# EAGLE schematic openvga (EAGLE 4.15)
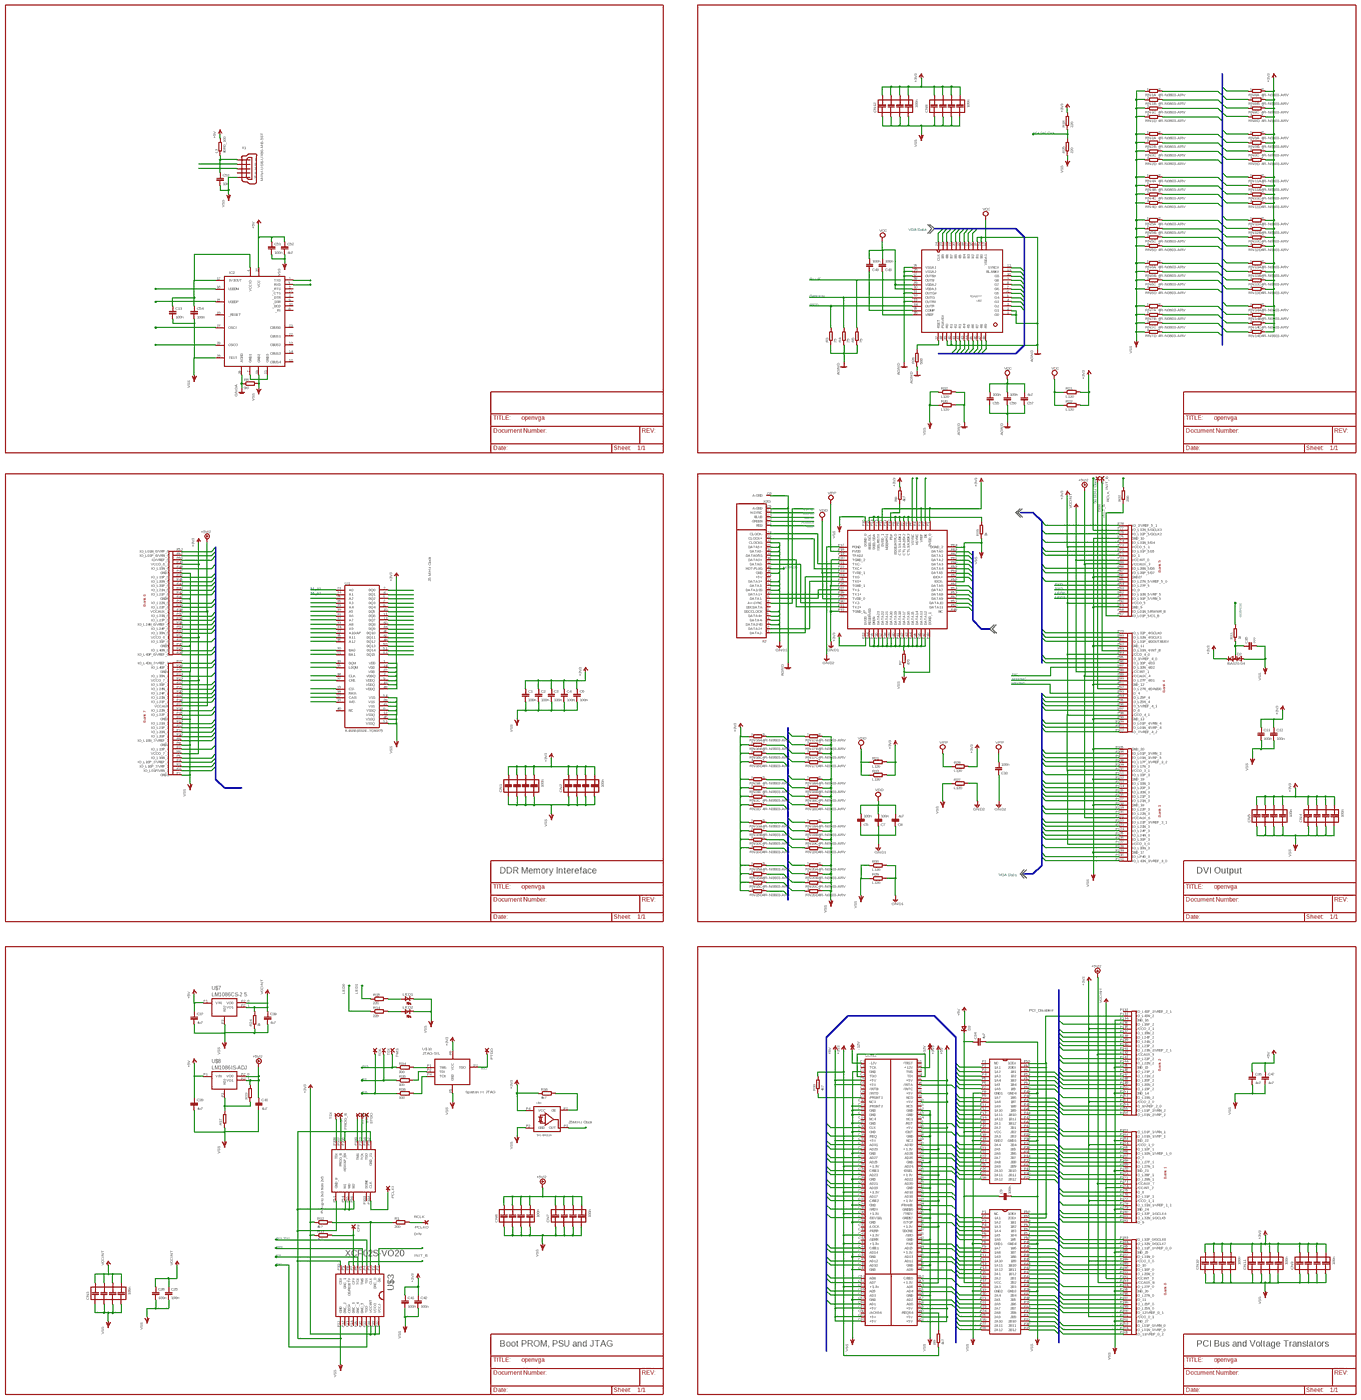
[diagram p0: schematic, sheet 1, overview]
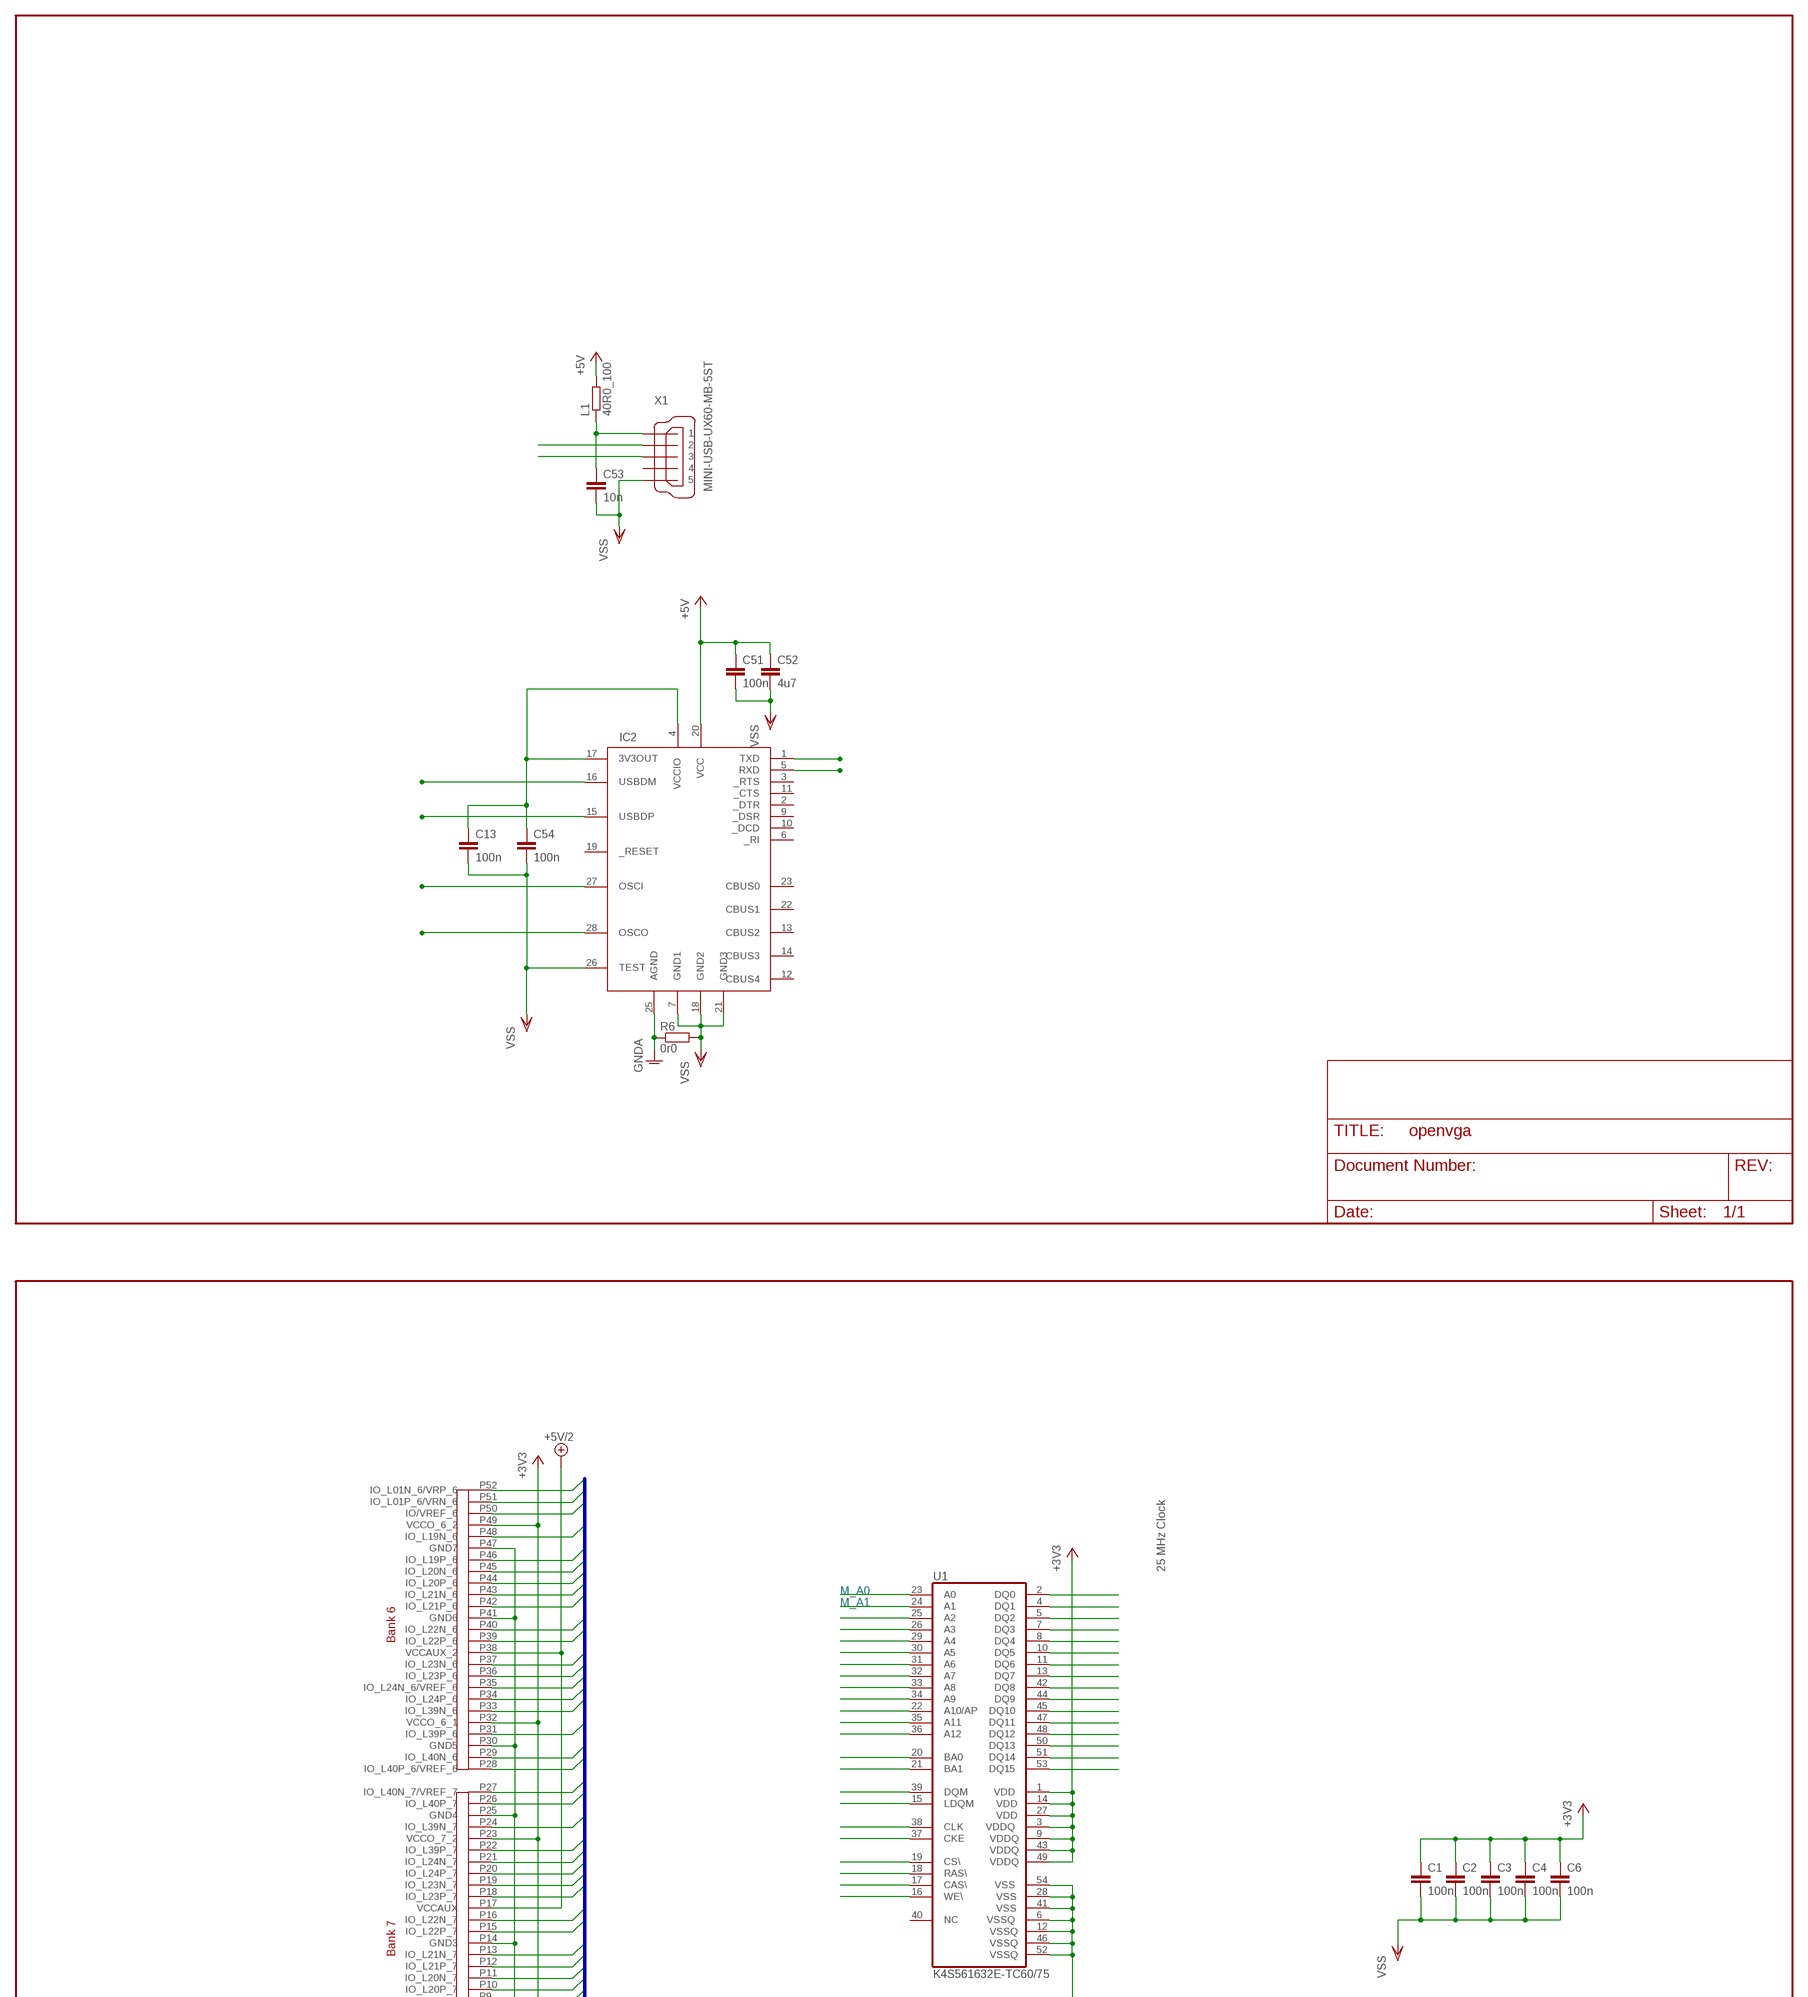
[diagram p1: schematic, sheet 1, part 1 of 4]
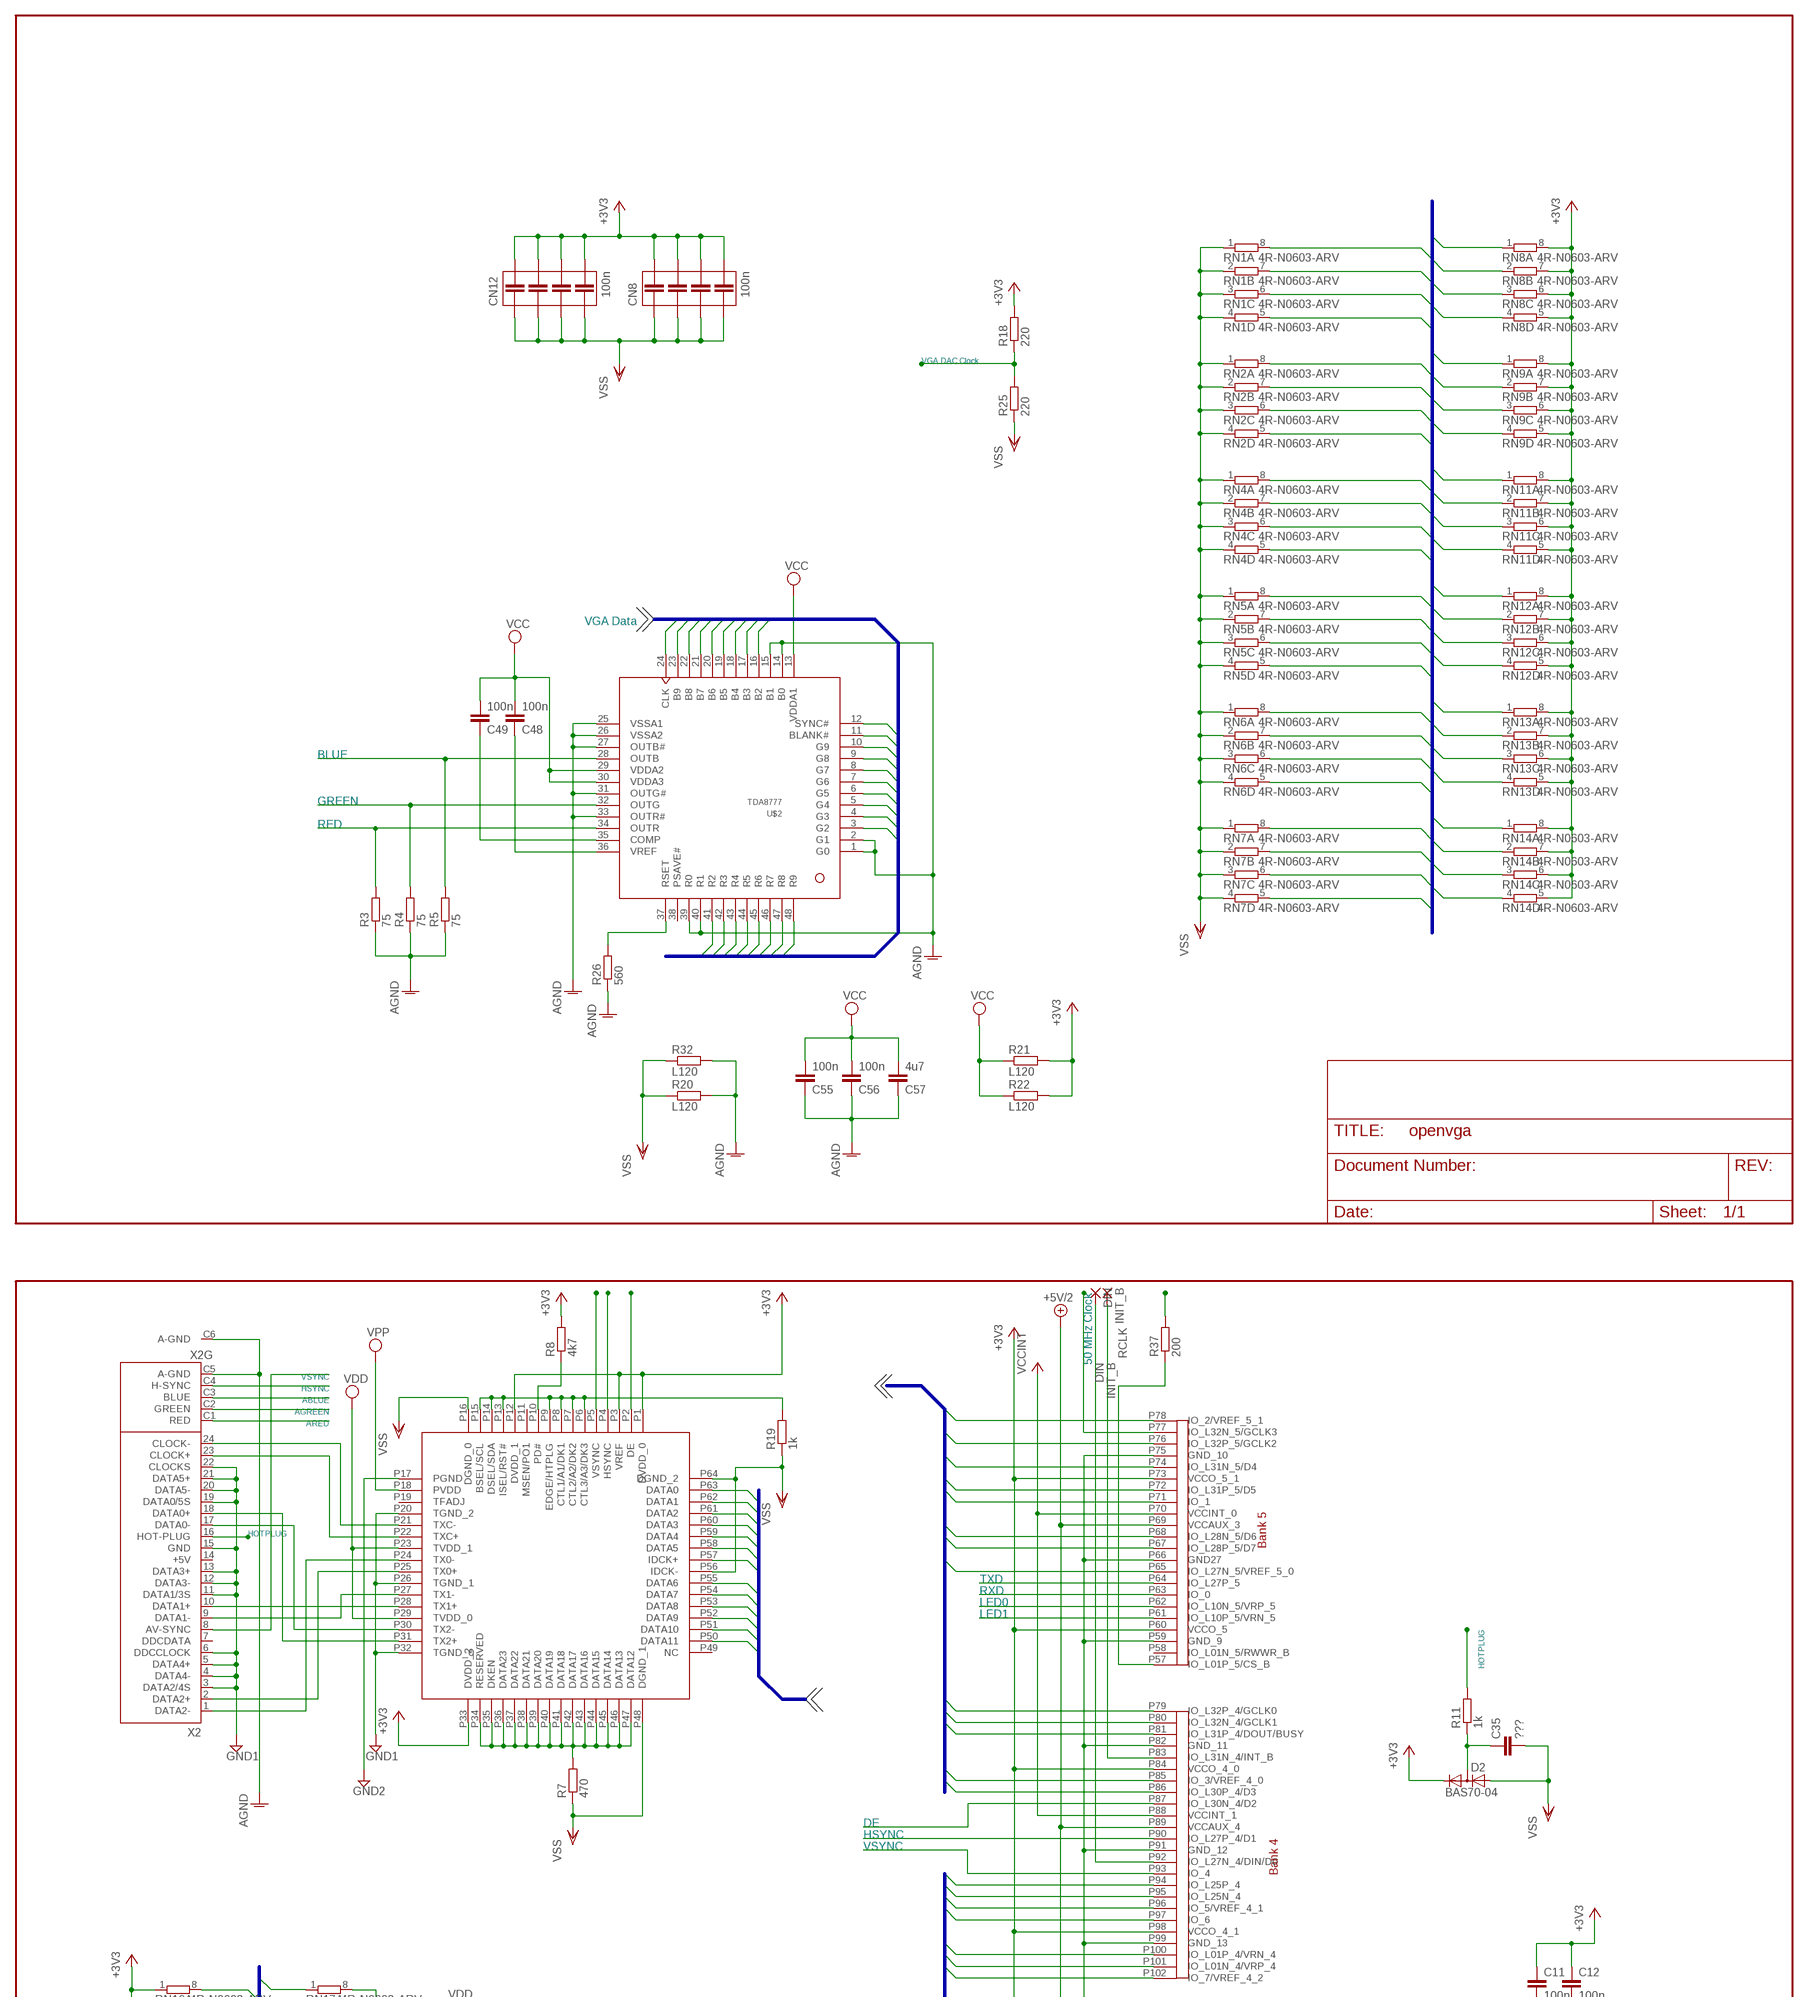
[diagram p2: schematic, sheet 1, part 2 of 4]
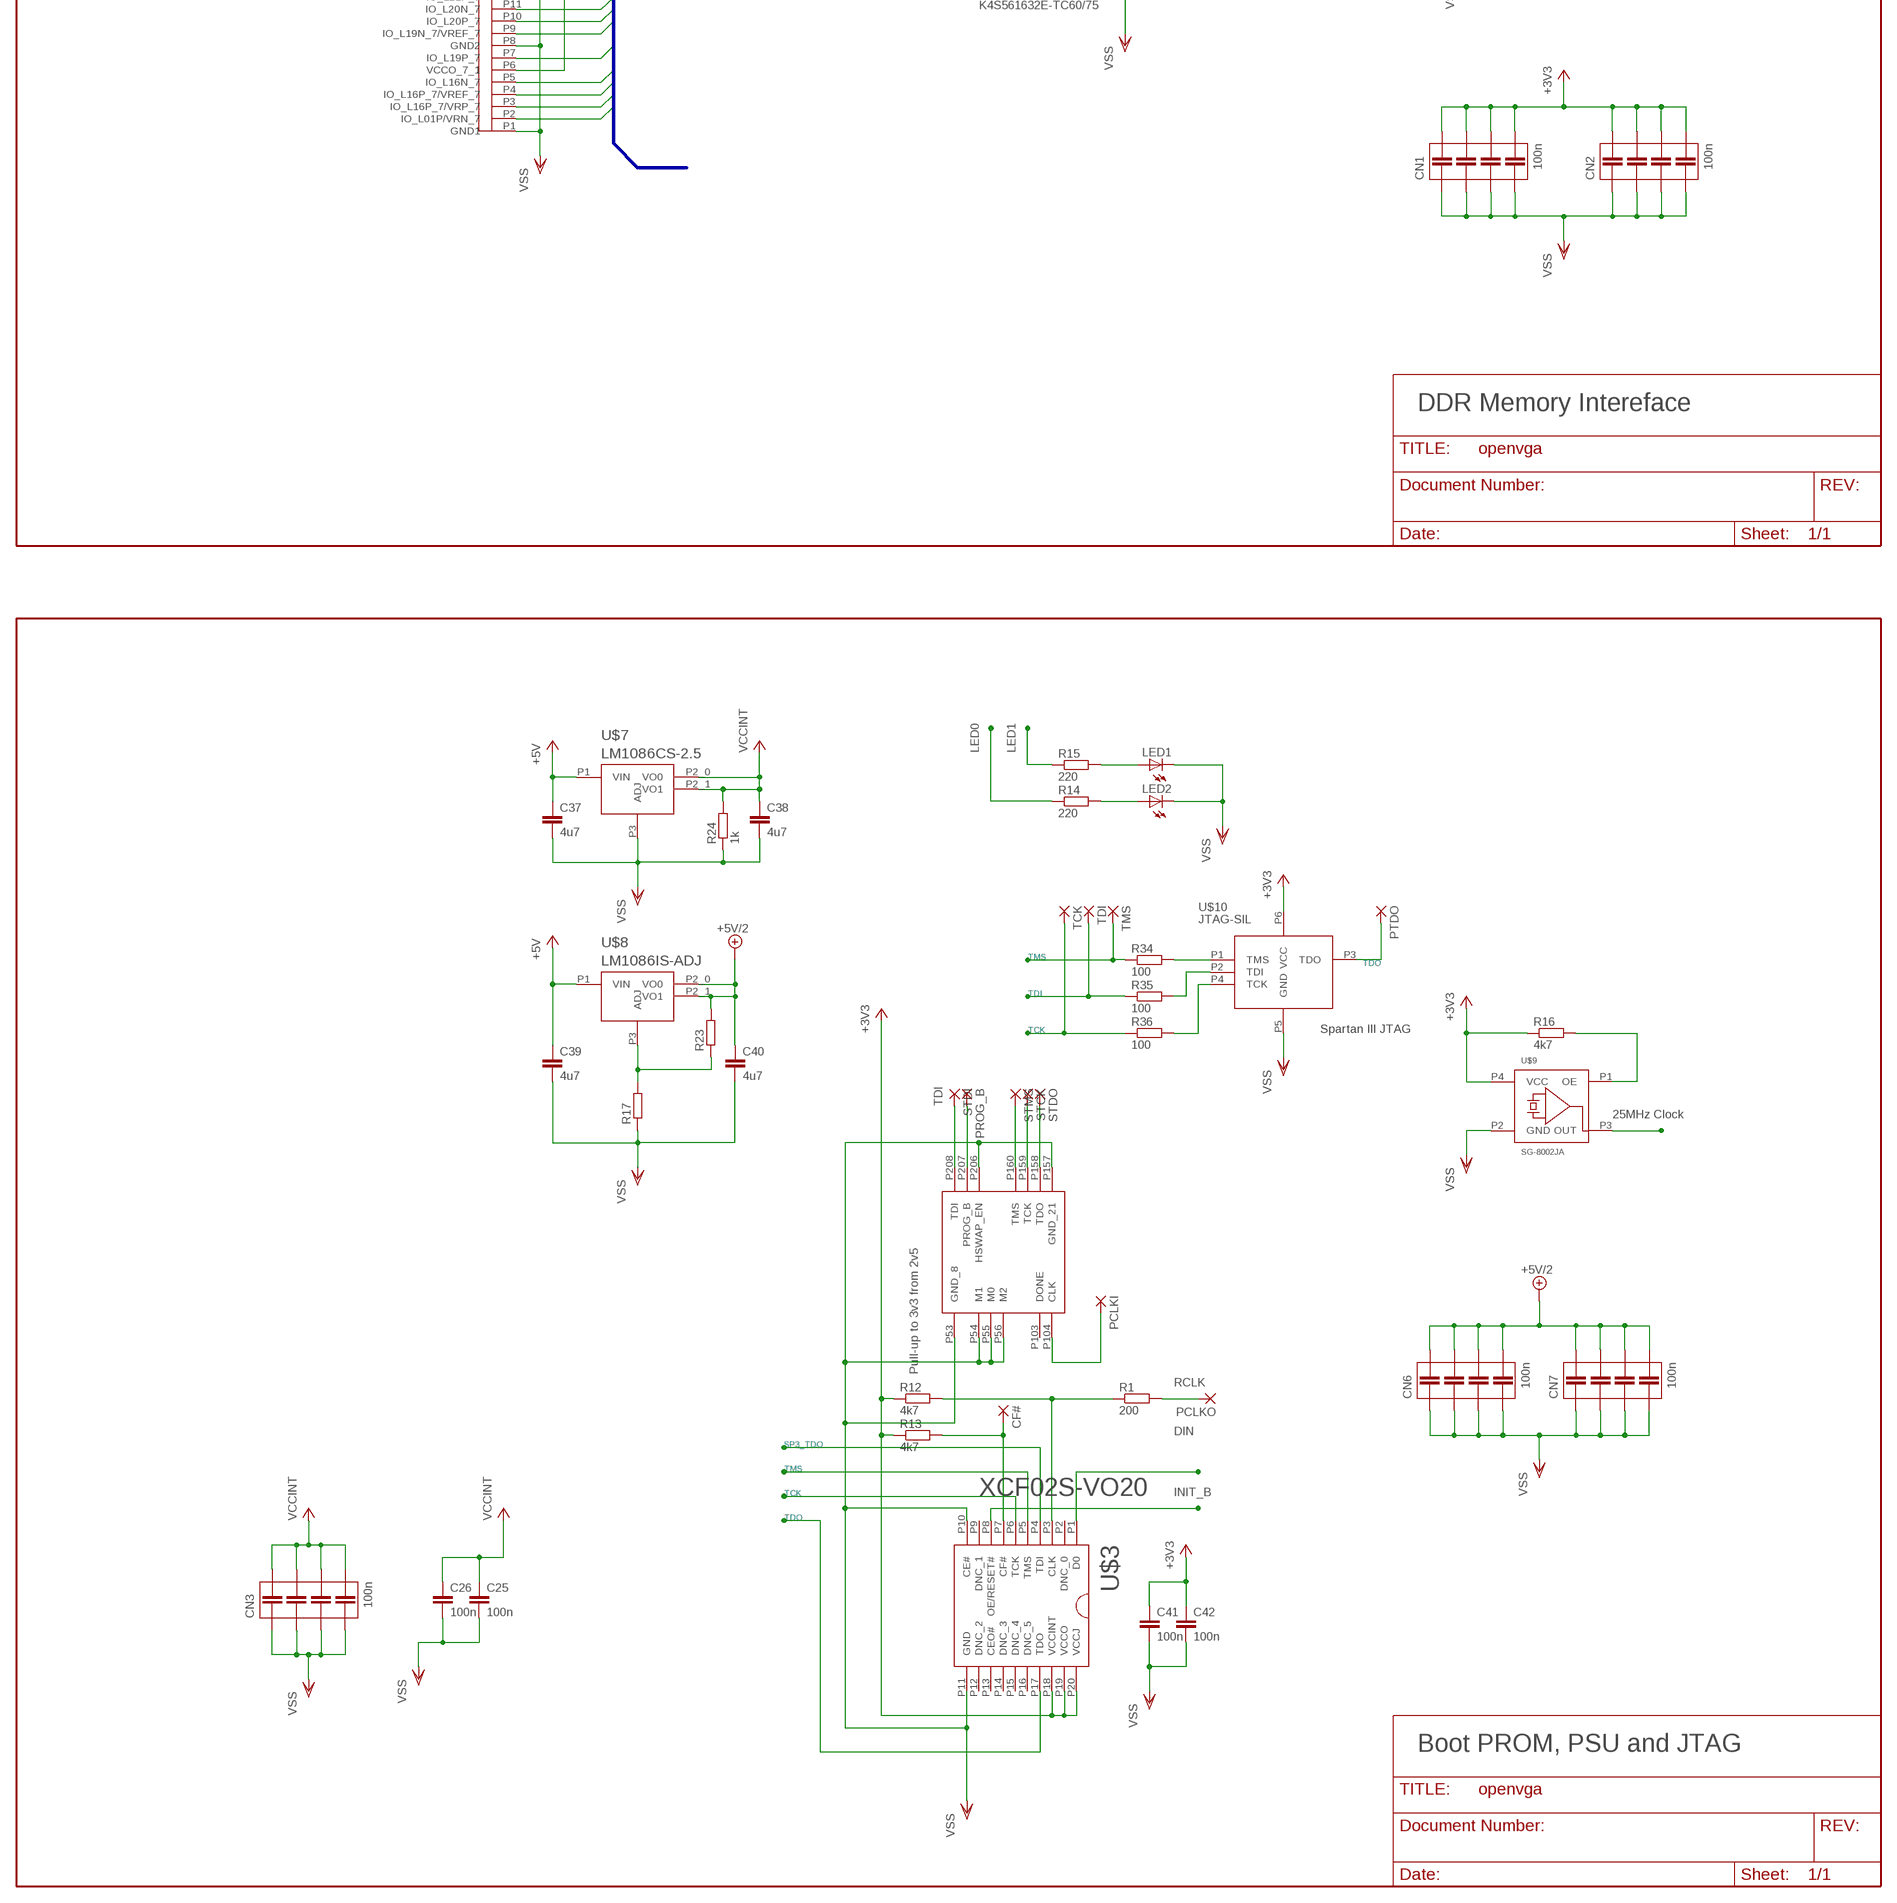
[diagram p3: schematic, sheet 1, part 3 of 4]
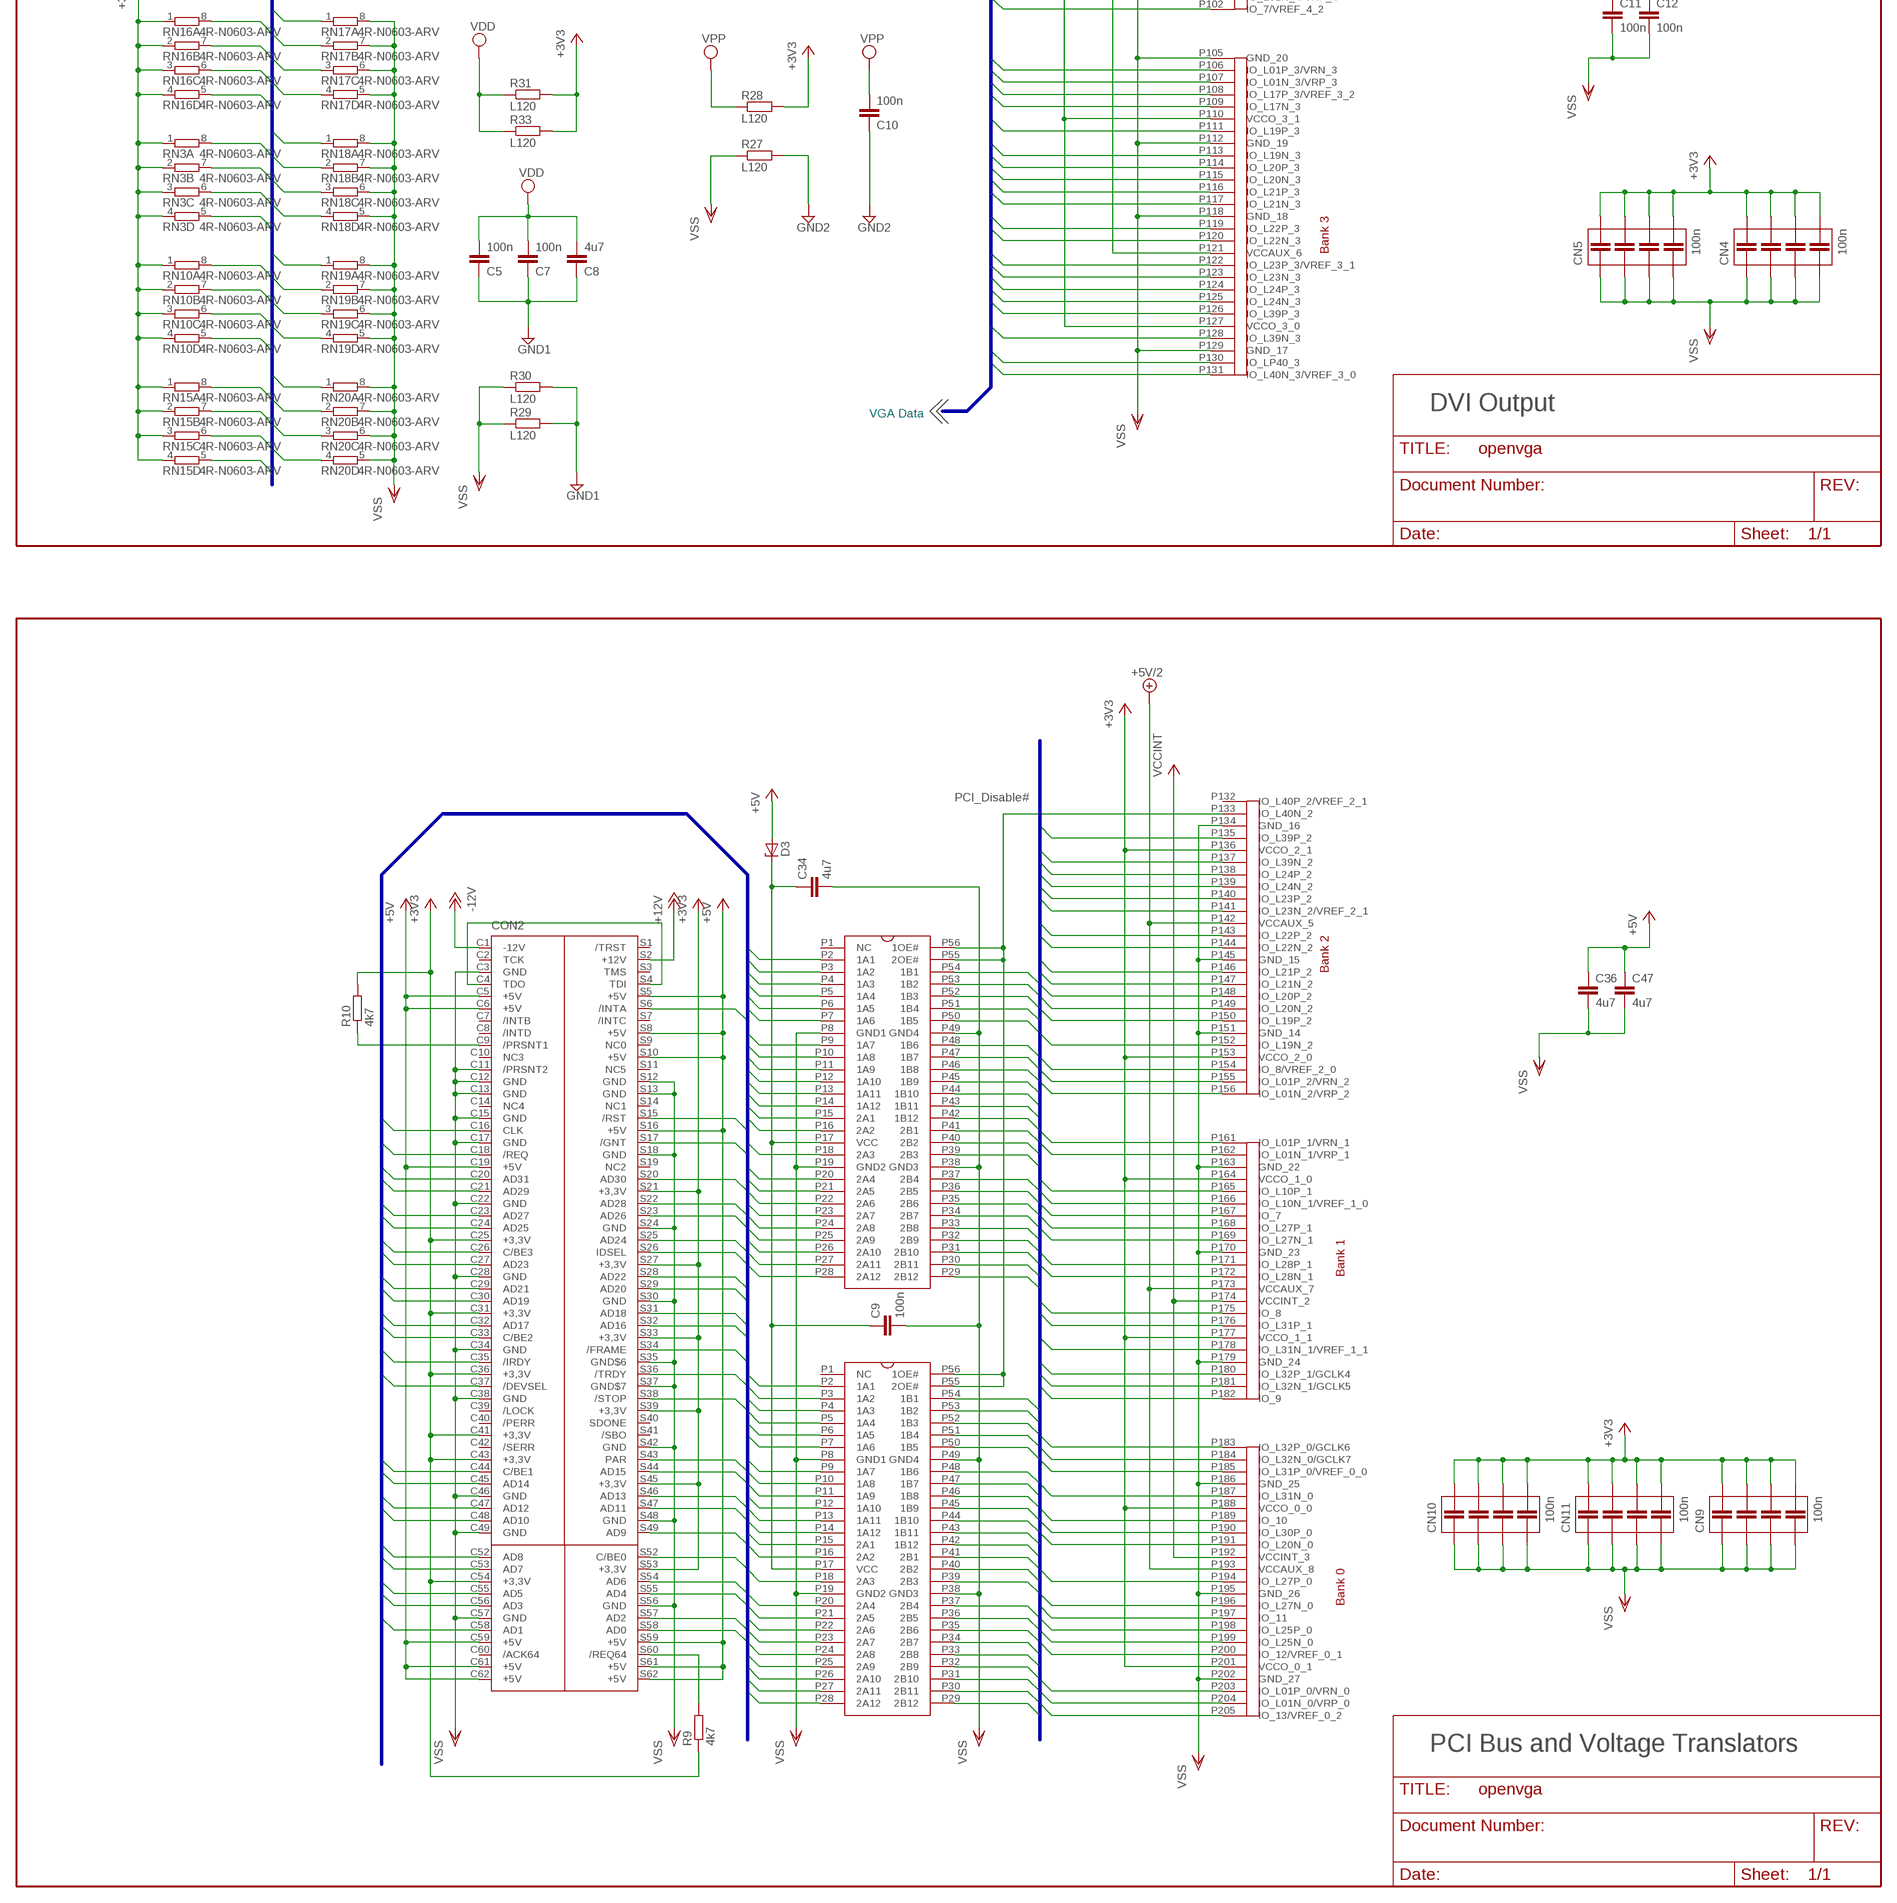
[diagram p4: schematic, sheet 1, part 4 of 4]

## Parts
C1  100n  C-EUC0603K  [C0603K]
C2  100n  C-EUC0603K  [C0603K]
C3  100n  C-EUC0603K  [C0603K]
C4  100n  C-EUC0603K  [C0603K]
C5  100n  C-EUC0603K  [C0603K]
C6  100n  C-EUC0603K  [C0603K]
C7  100n  C-EUC0603K  [C0603K]
C8  4u7  C-EUC0603K  [C0603K]
C9  100n  C-EUC0603K  [C0603K]
C10  100n  C-EUC0603K  [C0603K]
C11  100n  C-EUC0603K  [C0603K]
C12  100n  C-EUC0603K  [C0603K]
C13  100n  C-EUC0603K  [C0603K]
C25  100n  C-EUC0603K  [C0603K]
C26  100n  C-EUC0603K  [C0603K]
C34  4u7  C-EUC0603K  [C0603K]
C35  ???  C-EUC0603K  [C0603K]
C36  4u7  C-EUC0603K  [C0603K]
C37  4u7  C-EUC0603K  [C0603K]
C38  4u7  C-EUC0603K  [C0603K]
C39  4u7  C-EUC0603K  [C0603K]
C40  4u7  C-EUC0603K  [C0603K]
C41  100n  C-EUC0603K  [C0603K]
C42  100n  C-EUC0603K  [C0603K]
C47  4u7  C-EUC0603K  [C0603K]
C48  100n  C-EUC0603K  [C0603K]
C49  100n  C-EUC0603K  [C0603K]
C51  100n  C-EUC0603K  [C0603K]
C52  4u7  C-EUC0603K  [C0603K]
C53  10n  C-EUC0603K  [C0603K]
C54  100n  C-EUC0603K  [C0603K]
C55  100n  C-EUC0603K  [C0603K]
C56  100n  C-EUC0603K  [C0603K]
C57  4u7  C-EUC0603K  [C0603K]
CF#  1,6/0,8  [1,6/0,8]
CN1  100n  GNM214B11C104MA01D  [CA4_0805]
CN2  100n  GNM214B11C104MA01D  [CA4_0805]
CN3  100n  GNM214B11C104MA01D  [CA4_0805]
CN4  100n  GNM214B11C104MA01D  [CA4_0805]
CN5  100n  GNM214B11C104MA01D  [CA4_0805]
CN6  100n  GNM214B11C104MA01D  [CA4_0805]
CN7  100n  GNM214B11C104MA01D  [CA4_0805]
CN8  100n  GNM214B11C104MA01D  [CA4_0805]
CN9  100n  GNM214B11C104MA01D  [CA4_0805]
CN10  100n  GNM214B11C104MA01D  [CA4_0805]
CN11  100n  GNM214B11C104MA01D  [CA4_0805]
CN12  100n  GNM214B11C104MA01D  [CA4_0805]
CON2  PCI_CON  [PCI_BRDL]
D2  BAS70-04  [SOT23]
D3  ZENER-DIODESOD80C  [SOD80C]
DIN  1,6/0,8  [1,6/0,8]
IC2  FT232RL  [SSOP28DB]
INIT_B  1,6/0,8  [1,6/0,8]
L1  40R0_100  R-EU_R0805  [R0805]
LED1  LEDSMT1206  [1206]
LED2  LEDSMT1206  [1206]
PCLKI  1,6/0,8  [1,6/0,8]
PCLKO  1,6/0,8  [1,6/0,8]
PROG_B  1,6/0,8  [1,6/0,8]
PTDO  1,6/0,8  [1,6/0,8]
R1  200  R-EU_R0603  [R0603]
R3  75  R-EU_R0603  [R0603]
R4  75  R-EU_R0603  [R0603]
R5  75  R-EU_R0603  [R0603]
R6  0r0  R-EU_R0603  [R0603]
R7  470  R-EU_R0603  [R0603]
R8  4k7  R-EU_R0603  [R0603]
R9  4k7  R-EU_R0603  [R0603]
R10  4k7  R-EU_R0603  [R0603]
R11  1k  R-EU_R0603  [R0603]
R12  4k7  R-EU_R0603  [R0603]
R13  4k7  R-EU_R0603  [R0603]
R14  220  R-EU_R0603  [R0603]
R15  220  R-EU_R0603  [R0603]
R16  4k7  R-EU_R0603  [R0603]
R17  R-EU_R0603  [R0603]
R18  220  R-EU_R0603  [R0603]
R19  1k  R-EU_R0603  [R0603]
R20  L120  R-EU_R0805  [R0805]
R21  L120  R-EU_R0805  [R0805]
R22  L120  R-EU_R0805  [R0805]
R23  R-EU_R0603  [R0603]
R24  1k  R-EU_R0603  [R0603]
R25  220  R-EU_R0603  [R0603]
R26  560  R-EU_R0603  [R0603]
R27  L120  R-EU_R0805  [R0805]
R28  L120  R-EU_R0805  [R0805]
R29  L120  R-EU_R0805  [R0805]
R30  L120  R-EU_R0805  [R0805]
R31  L120  R-EU_R0805  [R0805]
R32  L120  R-EU_R0805  [R0805]
R33  L120  R-EU_R0805  [R0805]
R34  100  R-EU_R0603  [R0603]
R35  100  R-EU_R0603  [R0603]
R36  100  R-EU_R0603  [R0603]
R37  200  R-EU_R0603  [R0603]
RN1  4R-N0603-ARV  [0603-ARV]
RN2  4R-N0603-ARV  [0603-ARV]
RN3  4R-N0603-ARV  [0603-ARV]
RN4  4R-N0603-ARV  [0603-ARV]
RN5  4R-N0603-ARV  [0603-ARV]
RN6  4R-N0603-ARV  [0603-ARV]
RN7  4R-N0603-ARV  [0603-ARV]
RN8  4R-N0603-ARV  [0603-ARV]
RN9  4R-N0603-ARV  [0603-ARV]
RN10  4R-N0603-ARV  [0603-ARV]
RN11  4R-N0603-ARV  [0603-ARV]
RN12  4R-N0603-ARV  [0603-ARV]
RN13  4R-N0603-ARV  [0603-ARV]
RN14  4R-N0603-ARV  [0603-ARV]
RN15  4R-N0603-ARV  [0603-ARV]
RN16  4R-N0603-ARV  [0603-ARV]
RN17  4R-N0603-ARV  [0603-ARV]
RN18  4R-N0603-ARV  [0603-ARV]
RN19  4R-N0603-ARV  [0603-ARV]
RN20  4R-N0603-ARV  [0603-ARV]
STCK  1,6/0,8  [1,6/0,8]
STDI  1,6/0,8  [1,6/0,8]
STDO  1,6/0,8  [1,6/0,8]
STMS  1,6/0,8  [1,6/0,8]
TCK  1,6/0,8  [1,6/0,8]
TDI  1,6/0,8  [1,6/0,8]
TMS  1,6/0,8  [1,6/0,8]
U1  K4S561632E-TC60/75  [TSOP54]
U$1  XC3S200-PQ208-2'TQFP'  [PQ208]
U$2  TDA8777  [LQFP-48]
U$3  XCF02S-VO20  [VO20]
U$4  SIL164  [TQFP64]
U$5  CBT16211DDG  [TSSOP56]
U$6  CBT16211DDG  [TSSOP56]
U$7  LM1086CS-2.5  LM1086IS-ADJ  [TO-263]
U$8  LM1086IS-ADJ  [TO-263]
U$9  SG-8002JA  [SG-8002JC]
U$10  JTAG-SIL  [JTAG-SIL]
X1  MINI-USB-UX60-MB-5ST  [UX60-MB-5ST]
X2  DVI-I-R  [DVI-I-R]

## Nets
3V_AD0: U$1.P205(IO_13/VREF_0_2) U$6.P29(2B12)
3V_AD1: U$1.P204(IO_L01N_0/VRP_0) U$6.P30(2B11)
3V_AD2: U$1.P203(IO_L01P_0/VRN_0) U$6.P31(2B10)
3V_AD3: U$1.P200(IO_12/VREF_0_1) U$6.P32(2B9)
3V_AD4: U$1.P199(IO_L25N_0) U$6.P33(2B8)
3V_AD5: U$1.P198(IO_L25P_0) U$6.P34(2B7)
3V_AD6: U$1.P197(IO_11) U$6.P35(2B6)
3V_AD7: U$1.P196(IO_L27N_0) U$6.P36(2B5)
3V_AD8: U$1.P191(IO_L20N_0) U$6.P39(2B3)
3V_AD9: U$1.P190(IO_L30P_0) U$6.P40(2B2)
3V_AD10: U$1.P189(IO_10) U$6.P41(2B1)
3V_AD11: U$1.P187(IO_L31N_0) U$6.P42(1B12)
3V_AD12: U$1.P185(IO_L31P_0/VREF_0_0) U$6.P43(1B11)
3V_AD13: U$1.P184(IO_L32N_0/GCLK7) U$6.P44(1B10)
3V_AD14: U$1.P183(IO_L32P_0/GCLK6) U$6.P45(1B9)
3V_AD15: U$1.P182(IO_9) U$6.P46(1B8)
3V_AD16: U$1.P167(IO_7) U$5.P30(2B11)
3V_AD17: U$1.P166(IO_L10N_1/VREF_1_0) U$5.P31(2B10)
3V_AD18: U$1.P165(IO_L10P_1) U$5.P32(2B9)
3V_AD19: U$1.P162(IO_L01N_1/VRP_1) U$5.P33(2B8)
3V_AD20: U$1.P161(IO_L01P_1/VRN_1) U$5.P34(2B7)
3V_AD21: U$1.P156(IO_L01N_2/VRP_2) U$5.P35(2B6)
3V_AD22: U$1.P155(IO_L01P_2/VRN_2) U$5.P36(2B5)
3V_AD23: U$1.P154(IO_8/VREF_2_0) U$5.P37(2B4)
3V_AD24: U$1.P149(IO_L20N_2) U$5.P41(2B1)
3V_AD25: U$1.P148(IO_L20P_2) U$5.P42(1B12)
3V_AD26: U$1.P147(IO_L21N_2) U$5.P43(1B11)
3V_AD27: U$1.P146(IO_L21P_2) U$5.P44(1B10)
3V_AD28: U$1.P144(IO_L22N_2) U$5.P45(1B9)
3V_AD29: U$1.P143(IO_L22P_2) U$5.P46(1B8)
3V_AD30: U$1.P141(IO_L23N_2/VREF_2_1) U$5.P47(1B7)
3V_AD31: U$1.P140(IO_L23P_2) U$5.P48(1B6)
3V_CBE#0: U$1.P194(IO_L27P_0) U$6.P37(2B4)
3V_CBE#1: U$1.P181(IO_L32N_1/GCLK5) U$6.P47(1B7)
3V_CBE#2: U$1.P168(IO_L27P_1) U$5.P29(2B12)
3V_CBE#3: U$1.P150(IO_L19P_2) U$5.P40(2B2)
3V_CLK: U$1.P180(IO_L32P_1/GCLK4) U$5.P52(1B3)
3V_DEVSEL#: U$1.P175(IO_8) U$6.P51(1B4)
3V_FRAME#: U$1.P169(IO_L27N_1) U$6.P54(1B1)
3V_GNT#: U$1.P138(IO_L24P_2) U$5.P51(1B4)
3V_IDSEL: U$1.P152(IO_L19N_2) U$5.P39(2B3)
3V_INTA#: U$1.P135(IO_L39P_2) U$5.P54(1B1)
3V_IRDY#: U$1.P171(IO_L28P_1) U$6.P53(1B2)
3V_PAR: U$1.P178(IO_L31N_1/VREF_1_1) U$6.P48(1B6)
3V_REQ#: U$1.P139(IO_L24N_2) U$5.P50(1B5)
3V_RST#: U$1.P137(IO_L39N_2) U$5.P53(1B2)
3V_STOP#: U$1.P176(IO_L31P_1) U$6.P50(1B5)
3V_TRDY#: U$1.P172(IO_L28N_1) U$6.P52(1B3)
5V_AD0: CON2.S58(AD0) U$6.P28(2A12)
5V_AD1: CON2.C58(AD1) U$6.P27(2A11)
5V_AD2: CON2.S57(AD2) U$6.P26(2A10)
5V_AD3: CON2.C56(AD3) U$6.P25(2A9)
5V_AD4: CON2.S55(AD4) U$6.P24(2A8)
5V_AD5: CON2.C55(AD5) U$6.P23(2A7)
5V_AD6: CON2.S54(AD6) U$6.P22(2A6)
5V_AD7: CON2.C53(AD7) U$6.P21(2A5)
5V_AD8: CON2.C52(AD8) U$6.P18(2A3)
5V_AD9: CON2.S49(AD9) U$6.P16(2A2)
5V_AD10: CON2.C48(AD10) U$6.P15(2A1)
5V_AD11: CON2.S47(AD11) U$6.P14(1A12)
5V_AD12: CON2.C47(AD12) U$6.P13(1A11)
5V_AD13: CON2.S46(AD13) U$6.P12(1A10)
5V_AD14: CON2.C45(AD14) U$6.P11(1A9)
5V_AD15: CON2.S44(AD15) U$6.P10(1A8)
5V_AD16: CON2.S32(AD16) U$5.P27(2A11)
5V_AD17: CON2.C32(AD17) U$5.P26(2A10)
5V_AD18: CON2.S31(AD18) U$5.P25(2A9)
5V_AD19: CON2.C30(AD19) U$5.P24(2A8)
5V_AD20: CON2.S29(AD20) U$5.P23(2A7)
5V_AD21: CON2.C29(AD21) U$5.P22(2A6)
5V_AD22: CON2.S28(AD22) U$5.P21(2A5)
5V_AD23: CON2.C27(AD23) U$5.P20(2A4)
5V_AD24: CON2.S25(AD24) U$5.P15(2A1)
5V_AD25: CON2.C24(AD25) U$5.P14(1A12)
5V_AD26: CON2.S23(AD26) U$5.P13(1A11)
5V_AD27: CON2.C23(AD27) U$5.P12(1A10)
5V_AD28: CON2.S22(AD28) U$5.P11(1A9)
5V_AD29: CON2.C21(AD29) U$5.P10(1A8)
5V_AD30: CON2.S20(AD30) U$5.P9(1A7)
5V_AD31: CON2.C20(AD31) U$5.P7(1A6)
5V_CBE#0: CON2.S52(C/BE0) U$6.P20(2A4)
5V_CBE#1: CON2.C44(C/BE1) U$6.P9(1A7)
5V_CBE#2: CON2.C33(C/BE2) U$5.P28(2A12)
5V_CBE#3: CON2.C26(C/BE3) U$5.P16(2A2)
5V_CLK: CON2.C16(CLK) U$5.P4(1A3)
5V_DEVSEL#: CON2.C37(/DEVSEL) U$6.P5(1A4)
5V_FRAME#: CON2.S34(/FRAME) U$6.P2(1A1)
5V_GNT#: CON2.S17(/GNT) U$5.P5(1A4)
5V_IDSEL: CON2.S26(IDSEL) U$5.P18(2A3)
5V_INTA#: CON2.S6(/INTA) U$5.P2(1A1)
5V_IRDY#: CON2.C35(/IRDY) U$6.P3(1A2)
5V_PAR: CON2.S43(PAR) U$6.P7(1A6)
5V_REQ#: CON2.C18(/REQ) U$5.P6(1A5)
5V_RST#: CON2.S15(/RST) U$5.P3(1A2)
5V_STOP#: CON2.S38(/STOP) U$6.P6(1A5)
5V_TRDY#: CON2.S36(/TRDY) U$6.P4(1A3)
+3V3: C1.1 C2.1 C3.1 C4.1 C6.1 C11.1 C12.1 C41.1 C42.1 CN1.1 CN1.2 CN1.3 CN1.4 CN2.1 CN2.2 CN2.3 CN2.4 CN4.1 CN4.2 CN4.3 CN4.4 CN5.1 CN5.2 CN5.3 CN5.4 CN8.1 CN8.2 CN8.3 CN8.4 CN9.1 CN9.2 CN9.3 CN9.4 CN10.1 CN10.2 CN10.3 CN10.4 CN11.1 CN11.2 CN11.3 CN11.4 CN12.1 CN12.2 CN12.3 CN12.4 CON2.C25(+3,3V) CON2.C31(+3,3V) CON2.C36(+3,3V) CON2.C41(+3,3V) CON2.C43(+3,3V) CON2.C54(+3,3V) CON2.S21(+3,3V) CON2.S27(+3,3V) CON2.S33(+3,3V) CON2.S39(+3,3V) CON2.S45(+3,3V) CON2.S53(+3,3V) D2.2(C) R8.2 R9.1 R10.2 R12.1 R13.1 R16.1 R18.2 R21.2 R22.2 R28.2 R31.2 R33.2 RN3.1 RN3.2 RN3.3 RN3.4 RN8.5 RN8.6 RN8.7 RN8.8 RN9.5 RN9.6 RN9.7 RN9.8 RN10.1 RN10.2 RN10.3 RN10.4 RN11.5 RN11.6 RN11.7 RN11.8 RN12.5 RN12.6 RN12.7 RN12.8 RN13.5 RN13.6 RN13.7 RN13.8 RN14.5 RN14.6 RN14.7 RN14.8 RN15.1 RN15.2 RN15.3 RN15.4 RN16.1 RN16.2 RN16.3 RN16.4 U1.1(VDD) U1.3(VDDQ) U1.9(VDDQ) U1.14(VDD) U1.27(VDD) U1.43(VDDQ) U1.49(VDDQ) U$1.P6(VCCO_7_1) U$1.P23(VCCO_7_2) U$1.P32(VCCO_6_1) U$1.P49(VCCO_6_2) U$1.P60(VCCO_5) U$1.P73(VCCO_5_1) U$1.P84(VCCO_4_0) U$1.P98(VCCO_4_1) U$1.P110(VCCO_3_1) U$1.P127(VCCO_3_0) U$1.P136(VCCO_2_1) U$1.P153(VCCO_2_0) U$1.P164(VCCO_1_0) U$1.P177(VCCO_1_1) U$1.P188(VCCO_0_0) U$1.P201(VCCO_0_1) U$3.P18(VCCINT) U$3.P19(VCCO) U$3.P20(VCCJ) U$4.P1(DVDD_0) U$4.P3(VREF) U$4.P12(DVDD_1) U$4.P33(DVDD_2) U$9.P4(VCC) U$10.P6(VCC)
+4V2: C9.1 C34.1 D3.C U$5.P17(VCC) U$6.P17(VCC)
+5V: C36.1 C37.1 C39.1 C47.1 C51.1 C52.1 CON2.C5(+5V) CON2.C6(+5V) CON2.C19(+5V) CON2.C59(+5V) CON2.C61(+5V) CON2.C62(+5V) CON2.S5(+5V) CON2.S8(+5V) CON2.S10(+5V) CON2.S16(+5V) CON2.S59(+5V) CON2.S61(+5V) CON2.S62(+5V) D3.A IC2.20(VCC) L1.2 U$7.P1(VIN) U$8.P1(VIN)
+5V/2: C40.1 CN6.1 CN6.2 CN6.3 CN6.4 CN7.1 CN7.2 CN7.3 CN7.4 R23.2 U$1.P17(VCCAUX) U$1.P38(VCCAUX_2) U$1.P69(VCCAUX_3) U$1.P89(VCCAUX_4) U$1.P121(VCCAUX_6) U$1.P142(VCCAUX_5) U$1.P173(VCCAUX_7) U$1.P193(VCCAUX_8) U$8.P2_0(VO0) U$8.P2_1(VO1)
+12V: CON2.S2(+12V)
-12V: CON2.C1(-12V)
ABLUE: R5.2 U$2.28(OUTB) X2.C3(BLUE)
AGND: C55.1 C56.1 C57.1 R3.1 R4.1 R5.1 R20.2 R26.1 R32.2 U$2.1(G0) U$2.2(G1) U$2.14(B0) U$2.15(B1) U$2.25(VSSA1) U$2.26(VSSA2) U$2.27(OUTB#) U$2.31(OUTG#) U$2.33(OUTR#) U$2.39(R0) U$2.40(R1) X2.C5(A-GND) X2.C6(A-GND)
AGREEN: R4.2 U$2.32(OUTG) X2.C2(GREEN)
ARED: R3.2 U$2.34(OUTR) X2.C1(RED)
B2: RN6.8 RN13.4 U$1.P120(IO_L22N_3) U$2.16(B2)
B3: RN6.7 RN13.3 U$1.P122(IO_L23P_3/VREF_3_1) U$2.17(B3)
B4: RN6.6 RN13.2 U$1.P123(IO_L23N_3) U$2.18(B4)
B5: RN6.5 RN13.1 U$1.P124(IO_L24P_3) U$2.19(B5)
B6: RN7.8 RN14.4 U$1.P125(IO_L24N_3) U$2.20(B6)
B7: RN7.7 RN14.3 U$1.P126(IO_L39P_3) U$2.21(B7)
B8: RN7.6 RN14.2 U$1.P128(IO_L39N_3) U$2.22(B8)
B9: RN7.5 RN14.1 U$1.P130(IO_LP40_3) U$2.23(B9)
BLANK#: U$1.P117(IO_L21N_3) U$2.11(BLANK#)
CCLK: R1.1 R12.2 U$3.P3(CLK)
CLK25: U$1.P77(IO_L32N_5/GCLK3) U$9.P3(OUT)
DE: RN16.7 RN17.3 U$1.P87(IO_L30N_4/D2) U$4.P2(DE)
DIN: U$3.P1(D0)
DVICLK: RN10.6 RN19.2 U$1.P76(IO_L32P_5/GCLK2) U$4.P57(IDCK+)
DVID0: RN16.8 RN17.4 U$1.P86(IO_L30P_4/D3) U$4.P63(DATA0)
DVID1: RN3.5 RN18.1 U$1.P85(IO_3/VREF_4_0) U$4.P62(DATA1)
DVID2: RN3.6 RN18.2 U$1.P81(IO_L31P_4/DOUT/BUSY) U$4.P61(DATA2)
DVID3: RN3.7 RN18.3 U$1.P80(IO_L32N_4/GCLK1) U$4.P60(DATA3)
DVID4: RN3.8 RN18.4 U$1.P79(IO_L32P_4/GCLK0) U$4.P59(DATA4)
DVID5: RN10.5 RN19.1 U$1.P78(IO_2/VREF_5_1) U$4.P58(DATA5)
DVID6: RN10.7 RN19.3 U$1.P74(IO_L31N_5/D4) U$4.P55(DATA6)
DVID7: RN10.8 RN19.4 U$1.P72(IO_L31P_5/D5) U$4.P54(DATA7)
DVID8: RN15.5 RN20.1 U$1.P71(IO_1) U$4.P53(DATA8)
DVID9: RN15.6 RN20.2 U$1.P68(IO_L28N_5/D6) U$4.P52(DATA9)
DVID10: RN15.7 RN20.3 U$1.P67(IO_L28P_5/D7) U$4.P51(DATA10)
DVID11: RN15.8 RN20.4 U$1.P65(IO_L27N_5/VREF_5_0) U$4.P50(DATA11)
G2: RN4.8 RN11.4 U$1.P107(IO_L01N_3/VRP_3) U$2.3(G2)
G3: RN4.7 RN11.3 U$1.P108(IO_L17P_3/VREF_3_2) U$2.4(G3)
G4: RN4.6 RN11.2 U$1.P109(IO_L17N_3) U$2.5(G4)
G5: RN4.5 RN11.1 U$1.P111(IO_L19P_3) U$2.6(G5)
G6: RN5.8 RN12.4 U$1.P113(IO_L19N_3) U$2.7(G6)
G7: RN5.7 RN12.3 U$1.P114(IO_L20P_3) U$2.8(G7)
G8: RN5.6 RN12.2 U$1.P115(IO_L20N_3) U$2.9(G8)
G9: RN5.5 RN12.1 U$1.P116(IO_L21P_3) U$2.10(G9)
GND1: C5.1 C7.1 C8.1 R29.2 R30.2 U$4.P20(TGND_2) U$4.P26(TGND_1) U$4.P32(TGND_0) X2.3(DATA2/4S) X2.4(DATA4-) X2.5(DATA4+) X2.6(DDCCLOCK) X2.11(DATA1/3S) X2.12(DATA3-) X2.13(DATA3+) X2.15(GND) X2.19(DATA0/5S) X2.20(DATA5-) X2.21(DATA5+) X2.22(CLOCKS)
GND2: C10.1 R27.2 U$4.P17(PGND)
GNDA: IC2.25(AGND) R6.1
HOTPLUG: R11.2 X2.16(HOT-PLUG)
HSYNC: RN16.6 RN17.2 U$1.P90(IO_L27P_4/D1) U$4.P4(HSYNC) X2.C4(H-SYNC)
INIT_B: U$3.P8(OE/RESET#)
LED0: R14.1 U$1.P62(IO_L10N_5/VRP_5)
LED1: R15.1 U$1.P61(IO_L10P_5/VRN_5)
M_A0: U1.23(A0) U$1.P42(IO_L21P_6)
M_A1: U1.24(A1) U$1.P40(IO_L22N_6)
M_A2: U1.25(A2) U$1.P39(IO_L22P_6)
M_A3: U1.26(A3) U$1.P37(IO_L23N_6)
M_A4: U1.29(A4) U$1.P13(IO_L21N_7)
M_A5: U1.30(A5) U$1.P12(IO_L21P_7)
M_A6: U1.31(A6) U$1.P11(IO_L20N_7)
M_A7: U1.32(A7) U$1.P10(IO_L20P_7)
M_A8: U1.33(A8) U$1.P9(IO_L19N_7/VREF_7)
M_A9: U1.34(A9) U$1.P7(IO_L19P_7)
M_A10: U1.22(A10/AP) U$1.P43(IO_L21N_6)
M_A11: U1.35(A11) U$1.P5(IO_L16N_7)
M_A12: U1.36(A12) U$1.P4(IO_L16P_7/VREF_7)
M_BA0: U1.20(BA0) U$1.P45(IO_L20N_6)
M_BA1: U1.21(BA1) U$1.P44(IO_L20P_6)
M_CAS#: U1.17(CAS\) U$1.P50(IO/VREF_6)
M_CKE: U1.37(CKE) U$1.P3(IO_L16P_7/VRP_7)
M_CLK: U1.38(CLK) U$1.P2(IO_L01P/VRN_7)
M_CS#: U1.19(CS\) U$1.P46(IO_L19P_6)
M_DQ0: U1.2(DQ0) U$1.P27(IO_L40N_7/VREF_7)
M_DQ1: U1.4(DQ1) U$1.P28(IO_L40P_6/VREF_6)
M_DQ2: U1.5(DQ2) U$1.P29(IO_L40N_6)
M_DQ3: U1.7(DQ3) U$1.P31(IO_L39P_6)
M_DQ4: U1.8(DQ4) U$1.P33(IO_L39N_6)
M_DQ5: U1.10(DQ5) U$1.P34(IO_L24P_6)
M_DQ6: U1.11(DQ6) U$1.P35(IO_L24N_6/VREF_6)
M_DQ7: U1.13(DQ7) U$1.P36(IO_L23P_6)
M_DQ8: U1.42(DQ8) U$1.P16(IO_L22N_7)
M_DQ9: U1.44(DQ9) U$1.P18(IO_L23P_7)
M_DQ10: U1.45(DQ10) U$1.P19(IO_L23N_7)
M_DQ11: U1.47(DQ11) U$1.P20(IO_L24P_7)
M_DQ12: U1.48(DQ12) U$1.P21(IO_L24N_7)
M_DQ13: U1.50(DQ13) U$1.P22(IO_L39P_7)
M_DQ14: U1.51(DQ14) U$1.P24(IO_L39N_7)
M_DQ15: U1.53(DQ15) U$1.P26(IO_L40P_7)
M_LDM: U1.15(LDQM) U$1.P52(IO_L01N_6/VRP_6)
M_RAS#: U1.18(RAS\) U$1.P48(IO_L19N_6)
M_UDM: U1.39(DQM) U$1.P15(IO_L22P_7)
M_WE#: U1.16(WE\) U$1.P51(IO_L01P_6/VRN_6)
N$2: CON2.S60(/REQ64) R9.2
N$3: R19.2 U$4.P6(CTL3/A3/DK3) U$4.P7(CTL2/A2/DK2) U$4.P8(CTL1/A1/DK1) U$4.P9(EDGE/HTPLG) U$4.P13(ISEL/RST#) U$4.P14(DSEL/SDA) U$4.P15(BSEL/SCL)
N$4: R7.2 U$4.P34(RESERVED) U$4.P35(DKEN) U$4.P36(DATA23) U$4.P37(DATA22) U$4.P38(DATA21) U$4.P39(DATA20) U$4.P40(DATA19) U$4.P41(DATA18) U$4.P42(DATA17) U$4.P43(DATA16) U$4.P44(DATA15) U$4.P45(DATA14) U$4.P46(DATA13) U$4.P47(DATA12)
N$5: R36.2 U$10.P4(TCK)
N$6: INIT_B.1(P) U$1.P83(IO_L31N_4/INT_B)
N$7: R37.1 U$1.P57(IO_L01P_5/CS_B)
N$8: CON2.C9(/PRSNT1) R10.1
N$9: R35.2 U$10.P2(TDI)
N$10: DIN.1(P) U$1.P92(IO_L27N_4/DIN/D0)
N$12: R34.2 U$10.P1(TMS)
N$13: R16.2 U$9.P1(OE)
N$14: CON2.C4(TDO) CON2.S4(TDI)
N$15: C35.1 D2.3(AC) R11.1
N$16: CF#.1(P) R13.2 U$3.P7(CF#)
N$17: PROG_B.1(P) U$1.P207(PROG_B)
N$19: LED1.A R15.2
N$20: LED2.A R14.2
N$28: IC2.27(OSCI)
N$29: IC2.28(OSCO)
PCI_OE: U$1.P133(IO_L40N_2) U$5.P55(2OE#) U$5.P56(1OE#) U$6.P55(2OE#) U$6.P56(1OE#)
PCLK: PCLKO.1(P) R1.2 R37.2
PD#: R8.1 U$4.P10(PD#)
PROM_TDI: U$3.P4(TDI)
PROM_TDO: PTDO.1(P) U$3.P17(TDO) U$10.P3(TDO)
R2: RN1.8 RN8.4 U$1.P94(IO_L25P_4) U$2.41(R2)
R3: RN1.7 RN8.3 U$1.P95(IO_L25N_4) U$2.42(R3)
R4: RN1.6 RN8.2 U$1.P96(IO_5/VREF_4_1) U$2.43(R4)
R5: RN1.5 RN8.1 U$1.P97(IO_6) U$2.44(R5)
R6: RN2.8 RN9.4 U$1.P100(IO_L01P_4/VRN_4) U$2.45(R6)
R7: RN2.7 RN9.3 U$1.P101(IO_L01N_4/VRP_4) U$2.46(R7)
R8: RN2.6 RN9.2 U$1.P102(IO_7/VREF_4_2) U$2.47(R8)
R9: RN2.5 RN9.1 U$1.P106(IO_L01P_3/VRN_3) U$2.48(R9)
RCLK: PCLKI.1(P) U$1.P104(CLK)
RSET: R26.2 U$2.37(RSET)
RXD: IC2.5(RXD) U$1.P63(IO_0)
SP3_TCK: STCK.1(P) U$1.P159(TCK)
SP3_TDI: STDI.1(P) U$1.P208(TDI)
SP3_TDO: STDO.1(P) U$1.P158(TDO)
SP3_TMS: STMS.1(P) U$1.P160(TMS)
SYNC#: U$1.P119(IO_L22P_3) U$2.12(SYNC#)
TCK: R36.1 TCK.1(P) U$3.P6(TCK)
TDI: R35.1 TDI.1(P)
TMS: R34.1 TMS.1(P) U$3.P5(TMS)
TX0N: U$4.P30(TX2-) X2.17(DATA0-)
TX0P: U$4.P31(TX2+) X2.18(DATA0+)
TX1N: U$4.P27(TX1-) X2.9(DATA1-)
TX1P: U$4.P28(TX1+) X2.10(DATA1+)
TX2N: U$4.P24(TX0-) X2.1(DATA2-)
TX2P: U$4.P25(TX0+) X2.2(DATA2+)
TXCN: U$4.P21(TXC-) X2.24(CLOCK-)
TXCP: U$4.P22(TXC+) X2.23(CLOCK+)
TXD: IC2.1(TXD) U$1.P64(IO_L27P_5)
USBDM: IC2.16(USBDM) X1.2
USBDP: IC2.15(USBDP) X1.3
VADJ: R17.2 R23.1 U$8.P3(ADJ)
VBUS1: C53.1 L1.1 X1.1
VCC: C48.2 C49.2 C55.2 C56.2 C57.2 R21.1 R22.1 U$2.13(VDDA1) U$2.29(VDDA2) U$2.30(VDDA3)
VCCINT: C25.1 C26.1 C38.1 CN3.1 CN3.2 CN3.3 CN3.4 R24.2 U$1.P70(VCCINT_0) U$1.P88(VCCINT_1) U$1.P174(VCCINT_2) U$1.P192(VCCINT_3) U$7.P2_0(VO0) U$7.P2_1(VO1)
VCCIO: C13.1 C54.1 IC2.4(VCCIO) IC2.17(3V3OUT)
VDD: C5.2 C7.2 C8.2 R31.1 R33.1 U$4.P23(TVDD_1) U$4.P29(TVDD_0)
VGA_COMP: C49.1 U$2.35(COMP)
VGA_VREF: C48.1 U$2.36(VREF)
VGACLK: R18.1 R25.2 U$1.P131(IO_L40N_3/VREF_3_0) U$2.24(CLK)
VPP: C10.2 R28.1 U$4.P18(PVDD)
VSS: C1.2 C2.2 C3.2 C4.2 C6.2 C9.2 C11.2 C12.2 C13.2 C25.2 C26.2 C34.2 C35.2 C36.2 C37.2 C38.2 C39.2 C40.2 C41.2 C42.2 C47.2 C51.2 C52.2 C53.2 C54.2 CN1.5 CN1.6 CN1.7 CN1.8 CN2.5 CN2.6 CN2.7 CN2.8 CN3.5 CN3.6 CN3.7 CN3.8 CN4.5 CN4.6 CN4.7 CN4.8 CN5.5 CN5.6 CN5.7 CN5.8 CN6.5 CN6.6 CN6.7 CN6.8 CN7.5 CN7.6 CN7.7 CN7.8 CN8.5 CN8.6 CN8.7 CN8.8 CN9.5 CN9.6 CN9.7 CN9.8 CN10.5 CN10.6 CN10.7 CN10.8 CN11.5 CN11.6 CN11.7 CN11.8 CN12.5 CN12.6 CN12.7 CN12.8 CON2.C3(GND) CON2.C11(/PRSNT2) CON2.C12(GND) CON2.C13(GND) CON2.C15(GND) CON2.C17(GND) CON2.C22(GND) CON2.C28(GND) CON2.C34(GND) CON2.C38(GND) CON2.C46(GND) CON2.C49(GND) CON2.C57(GND) CON2.S12(GND) CON2.S13(GND) CON2.S18(GND) CON2.S24(GND) CON2.S30(GND) CON2.S35(GND$6) CON2.S37(GND$7) CON2.S42(GND) CON2.S48(GND) CON2.S56(GND) D2.1(A) IC2.7(GND1) IC2.18(GND2) IC2.21(GND3) IC2.26(TEST) LED1.C LED2.C R6.2 R7.1 R17.1 R19.1 R20.1 R24.1 R25.1 R27.1 R29.1 R30.1 R32.1 RN1.1 RN1.2 RN1.3 RN1.4 RN2.1 RN2.2 RN2.3 RN2.4 RN4.1 RN4.2 RN4.3 RN4.4 RN5.1 RN5.2 RN5.3 RN5.4 RN6.1 RN6.2 RN6.3 RN6.4 RN7.1 RN7.2 RN7.3 RN7.4 RN17.5 RN17.6 RN17.7 RN17.8 RN18.5 RN18.6 RN18.7 RN18.8 RN19.5 RN19.6 RN19.7 RN19.8 RN20.5 RN20.6 RN20.7 RN20.8 U1.6(VSSQ) U1.12(VSSQ) U1.28(VSS) U1.41(VSS) U1.46(VSSQ) U1.52(VSSQ) U1.54(VSS) U$1.P1(GND1) U$1.P8(GND2) U$1.P14(GND3) U$1.P25(GND4) U$1.P30(GND5) U$1.P41(GND6) U$1.P47(GND7) U$1.P53(GND_8) U$1.P54(M1) U$1.P55(M0) U$1.P56(M2) U$1.P59(GND_9) U$1.P66(GND27) U$1.P75(GND_10) U$1.P82(GND_11) U$1.P91(GND_12) U$1.P99(GND_13) U$1.P105(GND_20) U$1.P112(GND_19) U$1.P118(GND_18) U$1.P129(GND_17) U$1.P134(GND_16) U$1.P145(GND_15) U$1.P151(GND_14) U$1.P157(GND_21) U$1.P163(GND_22) U$1.P170(GND_23) U$1.P179(GND_24) U$1.P186(GND_25) U$1.P195(GND_26) U$1.P202(GND_27) U$1.P206(HSWAP_EN) U$3.P10(CE#) U$3.P11(GND) U$4.P16(DGND_0) U$4.P48(DGND_1) U$4.P56(IDCK-) U$4.P64(DGND_2) U$5.P8(GND1) U$5.P19(GND2) U$5.P38(GND3) U$5.P49(GND4) U$6.P8(GND1) U$6.P19(GND2) U$6.P38(GND3) U$6.P49(GND4) U$7.P3(ADJ) U$9.P2(GND) U$10.P5(GND) X1.5
VSYNC: RN16.5 RN17.1 U$1.P93(IO_4) U$4.P5(VSYNC) X2.8(AV-SYNC)
Unconnected: CON2.C2(TCK) CON2.C7(/INTB) CON2.C8(/INTD) CON2.C10(NC3) CON2.C14(NC4) CON2.C39(/LOCK) CON2.C40(/PERR) CON2.C42(/SERR) CON2.C60(/ACK64) CON2.S1(/TRST) CON2.S3(TMS) CON2.S7(/INTC) CON2.S9(NC0) CON2.S11(NC5) CON2.S14(NC1) CON2.S19(NC2) CON2.S40(SDONE) CON2.S41(/SBO) IC2.2(_DTR) IC2.3(_RTS) IC2.6(_RI) IC2.9(_DSR) IC2.10(_DCD) IC2.11(_CTS) IC2.12(CBUS4) IC2.13(CBUS2) IC2.14(CBUS3) IC2.19(_RESET) IC2.22(CBUS1) IC2.23(CBUS0) U1.40(NC) U$1.P58(IO_L01N_5/RWWR_B) U$1.P103(DONE) U$1.P132(IO_L40P_2/VREF_2_1) U$2.38(PSAVE#) U$3.P2(DNC_0) U$3.P9(DNC_1) U$3.P12(DNC_2) U$3.P13(CEO#) U$3.P14(DNC_3) U$3.P15(DNC_4) U$3.P16(DNC_5) U$4.P11(MSEN/PO1) U$4.P19(TFADJ) U$4.P49(NC) U$5.P1(NC) U$6.P1(NC) X1.4 X2.7(DDCDATA)

## Buses
5V_CLK,5V_RST#,5V_AD[0..31],5V_CBE#[0..3],5V_FRAME#,5V_DEVSEL#,5V_IRDY#,5V_TRDY#,5V_IDSEL,5V_INTA#,5V_STOP#,5V_REQ#,5V_GNT#,5V_PAR
3V_CLK,3V_RST#,3V_AD[0..31],3V_CBE#[0..3],3V_FRAME#,3V_DEVSEL#,3V_IRDY#,3V_TRDY#,3V_IDSEL,3V_INTA#,3V_STOP#,3V_REQ#,3V_GNT#,3V_PAR
R[0..9],G[0..9],B[0..9],SYNC#,BLANK#,VGACLK
R[2..9],G[2..9],B[2..9],SYNC#,BLANK#,VGACLK
DVID[0..11],DVICLK,HSYNC,VSYNC,DE
M_DQ[0..15],M_A[0..12],M_BA[0..1],M_RAS#,M_CAS#,M_WE#,M_CS#,M_CLK,M_CKE,M_UDM,M_LDM

## Notes on the sheet
- VGA DAC Clock
- USBDM
- USBDP
- VGA Data
- TXD | BLUE
- RXD
- USBDM
- GREEN
- USBDP
- RED
- NC
- NC
- 50 MHz Clock
- RCLK
- DIN | INIT_B
- VSYNC
- HSYNC
- ABLUE
- AGREEN
- ARED
- HOTPLUG
- 25 MHz Clock
- TXD
- M_A0 | RXD
- M_A1 | LED0
- LED1
- HOTPLUG
- DE
- HSYNC
- VSYNC
- DDR Memory Intereface | DVI Output
- VGA Data
- LED0 | LED1
- PCI_Disable#
- TMS | TDO
- TDI
- TCK | Spartan III JTAG
- TDI
- 25MHz Clock
- Pull-up to 3v3 from 2v5
- RCLK
- DIN
- SP3_TDO
- TMS
- TCK | INIT_B
- TDO
- Boot PROM, PSU and JTAG | PCI Bus and Voltage Translators

## Power pins joined to a net without a drawn wire
+5V: X2.14(+5V)

## Library data of the parts
C1-C13 C25 C26 C34-C42 C47-C49 C51-C57 = rcl:C-EU: CAPACITOR, European symbol
CF# DIN INIT_B PCLKI PCLKO PROG_B PTDO STCK STDI STDO STMS TCK TDI TMS = wirepad:1,6/0,8: THROUGH-HOLE PAD
CN1-CN12 = freega:GNM214B11C104MA01D
CON2 = freega:PCI_CON: PCI BOARD LONG
D2 = diode:BAS70-04: Silicon Schottky Diodes General-purpose diode for high-speed switching
D3 = diode:ZENER-DIODE: Z-Diode
IC2 = ftdichip:FT232RL: USB UART 4th Generation USB UART (USB <-> Serial) Controller
L1 R1 R3-R37 = rcl:R-EU_: RESISTOR, European symbol
LED1 LED2 = led:LED: LED OSRAM: - CHIPLED LG R971, LG N971, LY N971, LG Q971, LY Q971, LO R971, LY R971 LH N974, LH R974 LS Q976, LO Q976, LY Q976 LO Q996 - Hyper CHIPLED LW Q18S LB Q993, LB Q99A, LB R99A - SideLED LS A670, LO A670, LY A670, LG A670, LP A670 LB A673, LV A673, LT A673, LW A673 LH A674 LY A675 LS A676, LA A676, LO A676, LY A676, LW A676 LS A679, LY A679, LG A679 - Hyper Micro SIDELED® LS Y876, LA Y876, LO Y876, LY Y876 LT Y87S - SmartLED LW L88C, LW L88S LB L89C, LB L89S, LG L890 LS L89K, LO L89K, LY L89K LS L896, LA L896, LO L896, LY L896 - TOPLED LS T670, LO T670, LY T670, LG T670, LP T670 LSG T670, LSP T670, LSY T670, LOP T670, LYG T670 LG T671, LOG T671, LSG T671 LB T673, LV T673, LT T673, LW T673 LH T674 LS T676, LA T676, LO T676, LY T676, LB T676, LH T676, LSB T676, LW T676 LB T67C, LV T67C, LT T67C, LS T67K, LO T67K, LY T67K, LW E67C LS E67B, LA E67B, LO E67B, LY E67B, LB E67C, LV E67C, LT E67C LW T67C LS T679, LY T679, LG T679 LS T770, LO T770, LY T770, LG T770, LP T770 LB T773, LV T773, LT T773, LW T773 LH T774 LS E675, LA E675, LY E675, LS T675 LS T776, LA T776, LO T776, LY T776, LB T776 LHGB T686 LT T68C, LB T68C - Hyper Mini TOPLED® LB M676 - Mini TOPLED Santana® LG M470 LS M47K, LO M47K, LY M47K Source: http://www.osram.convergy.de/
RN1-RN20 = resistor-dil:4R-N: Array Chip Resistor Source: RS Component / Phycomp
U1 = memory-samsung2:K4S561632E-TC60/75: CMOS SDRAM 256Mb, Samsung
U$1 = xilinx:XC3S200-PQ208-2
U$2 = freega:TDA8777
U$3 = xilinx:XCF02S-VO20
U$4 = dvi:SIL164
U$5 U$6 = busswitch:CBT16211DDG
U$7 U$8 = power-regulators:LM1086IS-ADJ
U$9 = epson:SG-8002JA
U$10 = connectors:JTAG-SIL
X1 = con-hirose:MINI-USB-: MINI USB Connector Source: http://www.hirose.co.jp/cataloge_hp/e24000019.pdf
X2 = dvi:DVI-I-R: CONNECTOR MiroCross(TM)-DVI i/0 plug and receptacle connector system (scart)